# Altium schematic sheet 40_MCU.SchDoc
size A2; PageSetup: Record=PageOptions|SelectedOnly=False|CenterHorizontal=True|CenterVertical=True|PrintScale=1.00|XCorrection=1.00|YCorrection=1.00|PrintKind=0|BorderSize=5000000|LeftOffset=0|BottomOffset=0|Orientation=2|PaperLength=1000|PaperWidth=1000|Scale=100|PaperSource=7|PrintQuality=-4|MediaType=1|DitherType=10|PaperKind=Letter 8 ½ x 11 Zoll|PrintScaleMode=1; document: xxx; type: ESL; version: 00; standard_checked: PPS-W; mod_ind: 0; mod_quan: 0; change_number: xxxxxx; material_number: 6.68x-xxx.0; replace_for_date: YYYY-MM-DD; replace_for_index: -; doc_type: ESP
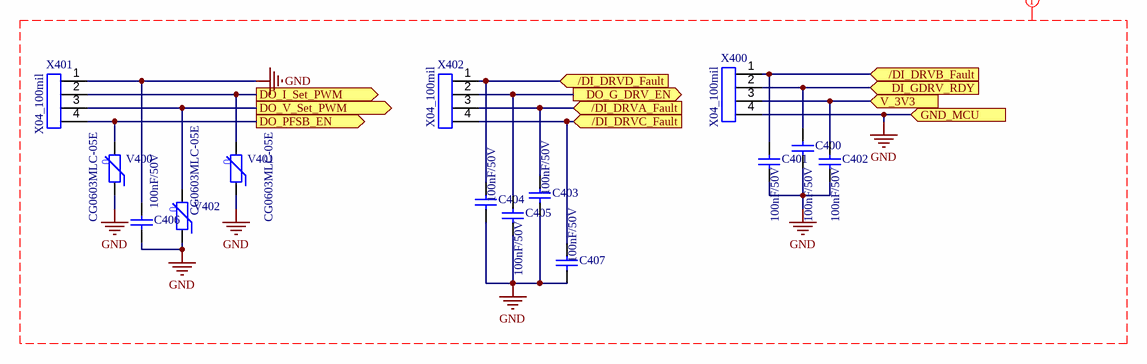
[diagram p0: 40_MCU.SchDoc]

## Parts
C400  100nF/50V  [EIA0603]
C401  100nF/50V  [EIA0603]
C402  100nF/50V  [EIA0603]
C403  100nF/50V  [EIA0603]
C404  100nF/50V  [EIA0603]
C405  100nF/50V  [EIA0603]
C406  100nF/50V  [EIA0603]
C407  100nF/50V  [EIA0603]
V400  CG0603MLC-05E  [EIA0603]
V401  CG0603MLC-05E  [EIA0603]
V402  CG0603MLC-05E  [EIA0603]
X400  X04_100mil  [X04_100mil]
X401  X04_100mil  [X04_100mil]
X402  X04_100mil  [X04_100mil]

## Ports
/DI_DRVA_Fault (in), /DI_DRVB_Fault (in), /DI_DRVC_Fault (in), /DI_DRVD_Fault (in), DI_GDRV_RDY (in), DO_G_DRV_EN (out), DO_I_Set_PWM (out), DO_PFSB_EN (out), DO_V_Set_PWM (out), GND_MCU (in), V_3V3 (in)

## Nets
GND: C400.1 C401.1 C402.1 C403.1 C404.1 C405.1 C406.1 C406.2 C407.1 V400.1 V401.1 V402.1 X400.4 X401.1 ; port GND_MCU
/DI_DRVA_Fault: C403.2 X402.3 ; port /DI_DRVA_Fault
/DI_DRVB_Fault: C401.2 X400.1 ; port /DI_DRVB_Fault
/DI_DRVC_Fault: C407.2 X402.4 ; port /DI_DRVC_Fault
/DI_DRVD_Fault: C404.2 X402.1 ; port /DI_DRVD_Fault
DI_GDRV_RDY: C400.2 X400.2 ; port DI_GDRV_RDY
DO_G_DRV_EN: C405.2 X402.2 ; port DO_G_DRV_EN
DO_I_Set_PWM: V401.2 X401.2 ; port DO_I_Set_PWM
DO_PFSB_EN: V400.2 X401.4 ; port DO_PFSB_EN
DO_V_Set_PWM: V402.2 X401.3 ; port DO_V_Set_PWM
V_3V3: C402.2 X400.3 ; port V_3V3

## Layout directives
net class LV_Net: GND

## Notes on the sheet
- Assembly variant:
- DIN ISO 2768-mK
- DIN ISO 8015
- standards
- general
- replace for
- replace for index
- DIN EN ISO 1302
- surface
- material number
- description
- document
- EBB
- number
- type
- ESP
- version
- date
- drawn by
- checked
- File:
- mod.
- ind.
- quan.
- change number
- sheet
- of
- (in symbol CG0603MLC-05E) U

## Library data of the parts
C400-C407 = C_Open_0603: Generic 0603 ceramic capacitor; Manufacturer: Open; ID: 3; Verified Lib: False; Manufacturer P/N: C_Open_0603; Category: Ceramic; Part_Value: 100nF/50V; Package/Case: 0603; Supplier-1: LCSC; Price: 0.02; created by: Hamad; created On: 12/15/2014
V400-V402 = CG0603MLC-05E: Bidirectional 5V, 25V 0603 Diodes - ESD RoHS; Manufacturer: Bourne Semicon; ID: 21; Verified Lib: False; Manufacturer P/N: CG0603MLC-05E; Category: ESD Suppressor; Part_Value: CG0603MLC-05E; Package/Case: 0603; Supplier-1: Mouser; Price: 0.19; created by: HamadA; created on: 11/16/2021
X400-X402 = 2304-6111-TP: 4 Pin THT Connector 100 mil pitch; Manufacturer: 3M; ID: 4; Verified Lib: False; Manufacturer P/N: 2304-6111-TP; Category: PCB Connector; Part_Value: X04_100mil; Package/Case: THT; Supplier-1: Digikey; Supplier Part Number 1: 2304-6111-TP-ND; created by: Hamad; created on: 7/25/2016